# Altium project DARKYDEN.PrjPcb (part 9 of 15)

## Sheet CONNECTEUR_1.SchDoc: DARKYDEN_CONNECTEUR_1
size Letter; ApprovedBy: APPROUVÉ PAR; Author: Harold Malbrouck; Organization: Cegep Limoilou; Address1: 1300, 8e Avenue; Address2: Québec, QC; Address3: Canada; Address4: G1J 5L5; Revision: Rev.B; SheetNumber: 11; SheetTotal: 22
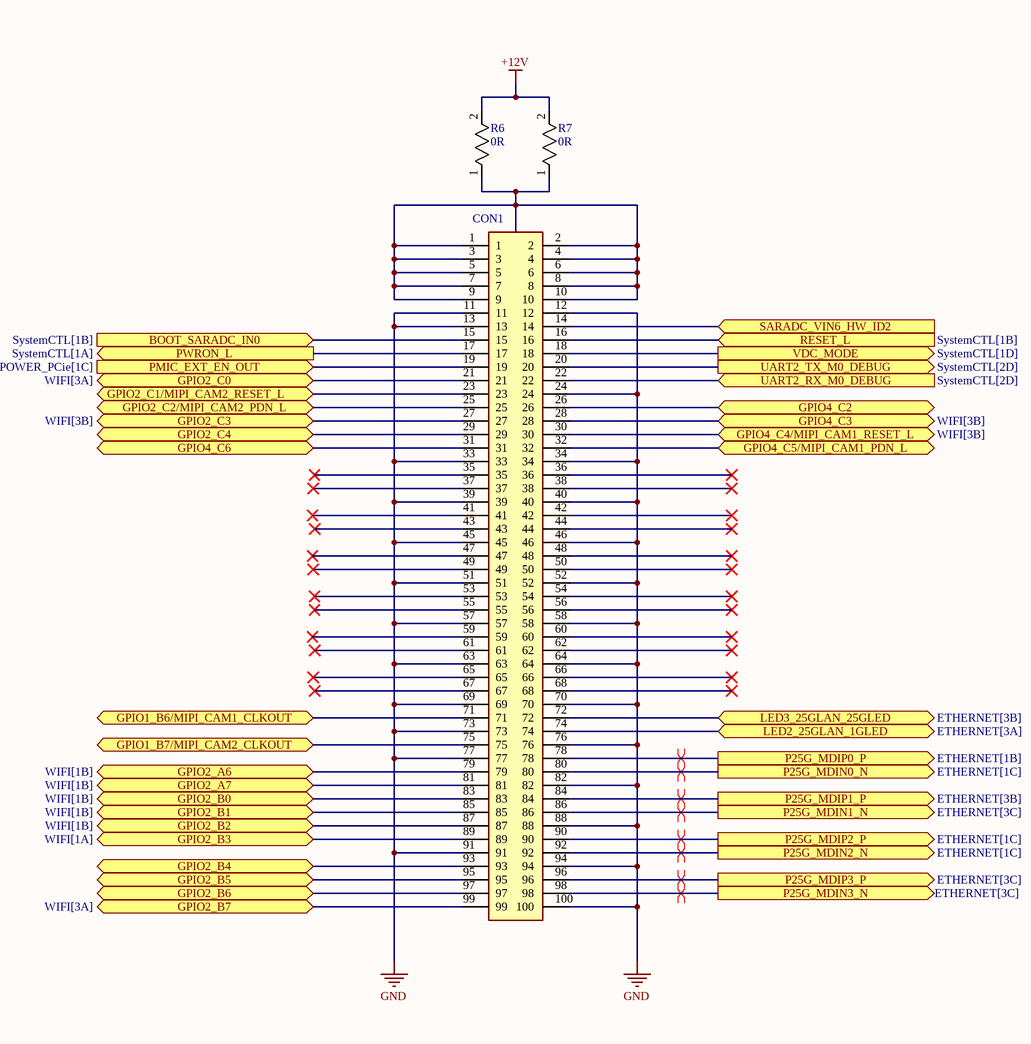
[diagram p10: CONNECTEUR_1.SchDoc, right]

### Parts
CON1  DF40HC  [DF40HC30100DS04V51]  (value not drawn)
R6  0R  [ERJ3EKF1000V]
R7  0R  [ERJ3EKF1000V]

### Ports
BOOT_SARADC_IN0 (in, see SystemCTL[1B]), GPIO1_B6/MIPI_CAM1_CLKOUT (bidir), GPIO1_B7/MIPI_CAM2_CLKOUT (bidir), GPIO2_A6 (bidir, see WIFI[1B]), GPIO2_A7 (bidir, see WIFI[1B]), GPIO2_B0 (bidir, see WIFI[1B]), GPIO2_B1 (bidir, see WIFI[1B]), GPIO2_B2 (bidir, see WIFI[1B]), GPIO2_B3 (bidir, see WIFI[1A]), GPIO2_B4 (bidir), GPIO2_B5 (bidir), GPIO2_B6 (bidir), GPIO2_B7 (bidir, see WIFI[3A]), GPIO2_C0 (bidir, see WIFI[3A]), GPIO2_C1/MIPI_CAM2_RESET_L (bidir), GPIO2_C2/MIPI_CAM2_PDN_L (bidir), GPIO2_C3 (bidir, see WIFI[3B]), GPIO2_C4 (bidir), GPIO4_C2 (bidir), GPIO4_C3 (bidir, see WIFI[3B]), GPIO4_C4/MIPI_CAM1_RESET_L (bidir, see WIFI[3B]), GPIO4_C5/MIPI_CAM1_PDN_L (bidir), GPIO4_C6 (bidir), LED2_25GLAN_1GLED (bidir, see ETHERNET[3A]), LED3_25GLAN_25GLED (bidir, see ETHERNET[3B]), P25G_MDIN0_N (out, see ETHERNET[1C]), P25G_MDIN1_N (out, see ETHERNET[3C]), P25G_MDIN2_N (out, see ETHERNET[1C]), P25G_MDIN3_N (out, see ETHERNET[3C]), P25G_MDIP0_P (out, see ETHERNET[1B]), P25G_MDIP1_P (out, see ETHERNET[3B]), P25G_MDIP2_P (out, see ETHERNET[1C]), P25G_MDIP3_P (out, see ETHERNET[3C]), PMIC_EXT_EN_OUT (in, see Power[1A], Power[1C], POWER_PCie[1B], POWER_PCie[1C]), PWRON_L (out, see SystemCTL[1A]), RESET_L (in, see SystemCTL[1B]), SARADC_VIN6_HW_ID2 (in), UART2_RX_M0_DEBUG (in, see SystemCTL[2D]), UART2_TX_M0_DEBUG (out, see SystemCTL[2D]), VDC_MODE (out, see SystemCTL[1D])

### Nets
+12V: R6.2 R7.2  [project net Vout]
GND: CON1.11 CON1.12 CON1.13 CON1.24 CON1.33 CON1.34 CON1.39 CON1.40 CON1.45 CON1.46 CON1.51 CON1.52 CON1.57 CON1.58 CON1.63 CON1.64 CON1.69 CON1.70 CON1.73 CON1.76 CON1.77 CON1.82 CON1.88 CON1.91 CON1.94 CON1.100  [project net PACK-]
BOOT_SARADC_IN0: CON1.15 ; port BOOT_SARADC_IN0
GPIO1_B6/MIPI_CAM1_CLKOUT: CON1.71 ; port GPIO1_B6/MIPI_CAM1_CLKOUT
GPIO1_B7/MIPI_CAM2_CLKOUT: CON1.75 ; port GPIO1_B7/MIPI_CAM2_CLKOUT
GPIO2_A6: CON1.79 ; port GPIO2_A6
GPIO2_A7: CON1.81 ; port GPIO2_A7
GPIO2_B0: CON1.83 ; port GPIO2_B0
GPIO2_B1: CON1.85 ; port GPIO2_B1
GPIO2_B2: CON1.87 ; port GPIO2_B2
GPIO2_B3: CON1.89 ; port GPIO2_B3
GPIO2_B4: CON1.93 ; port GPIO2_B4
GPIO2_B5: CON1.95 ; port GPIO2_B5
GPIO2_B6: CON1.97 ; port GPIO2_B6
GPIO2_B7: CON1.99 ; port GPIO2_B7
GPIO2_C0: CON1.21 ; port GPIO2_C0
GPIO2_C1/MIPI_CAM2_RESET_L: CON1.23 ; port GPIO2_C1/MIPI_CAM2_RESET_L
GPIO2_C2/MIPI_CAM2_PDN_L: CON1.25 ; port GPIO2_C2/MIPI_CAM2_PDN_L
GPIO2_C3: CON1.27 ; port GPIO2_C3
GPIO2_C4: CON1.29 ; port GPIO2_C4
GPIO4_C2: CON1.26 ; port GPIO4_C2
GPIO4_C3: CON1.28 ; port GPIO4_C3
GPIO4_C4/MIPI_CAM1_RESET_L: CON1.30 ; port GPIO4_C4/MIPI_CAM1_RESET_L
GPIO4_C5/MIPI_CAM1_PDN_L: CON1.32 ; port GPIO4_C5/MIPI_CAM1_PDN_L
GPIO4_C6: CON1.31 ; port GPIO4_C6
LED2_25GLAN_1GLED: CON1.74 ; port LED2_25GLAN_1GLED
LED3_25GLAN_25GLED: CON1.72 ; port LED3_25GLAN_25GLED
MDIP0_N: CON1.80 ; port P25G_MDIN0_N
MDIP0_P: CON1.78 ; port P25G_MDIP0_P
MDIP1_N: CON1.86 ; port P25G_MDIN1_N
MDIP1_P: CON1.84 ; port P25G_MDIP1_P
MDIP2_N: CON1.92 ; port P25G_MDIN2_N
MDIP2_P: CON1.90 ; port P25G_MDIP2_P
MDIP3_N: CON1.98 ; port P25G_MDIN3_N
MDIP3_P: CON1.96 ; port P25G_MDIP3_P
PMIC_EXT_EN_OUT: CON1.19 ; port PMIC_EXT_EN_OUT
PWRON_L: CON1.17 ; port PWRON_L
RESET_L: CON1.16 ; port RESET_L
SARADC_VIN6_HW_ID2: CON1.14 ; port SARADC_VIN6_HW_ID2
UART2_RX_M0_DEBUG: CON1.22 ; port UART2_RX_M0_DEBUG
UART2_TX_M0_DEBUG: CON1.20 ; port UART2_TX_M0_DEBUG
VDC_MODE: CON1.18 ; port VDC_MODE
NetCON1_1: CON1.1 CON1.2 CON1.3 CON1.4 CON1.5 CON1.6 CON1.7 CON1.8 CON1.9 CON1.10 R6.1 R7.1

Not connected (* = marked no-connect by the designer): CON1 35* 36* 37* 38* 41* 42* 43* 44* 47* 48* 49* 50* 53* 54* 55* 56* 59* 60* 61* 62* 65* 66* 67* 68*

### Layout directives
differential pair: MDIP0_N, MDIP0_P, MDIP1_N, MDIP1_P, MDIP2_N, MDIP2_P, MDIP3_N, MDIP3_P

### Notes on the sheet
- Titre :
- Conception :
- Date :
- Approbation :
- Heure :
- Révision :
- Feuille
- de
- Fichier :

### Library data of the parts
CON1 = DF40HC(3.0)-100DS-0.4V(51): Stacking Board Connector, DF40 Series, Receptacle, 0.4 mm, 100, Surface Mount, G; Manufacturer_Name: Hirose; Number of Positions: 100; Contact Resistance: 90mR; Contact Voltage Rating (AC): 30V; Current Rating: 300mA; Mated Stacking Heights: 3mm; Contact Pitch: 400um; Datasheet Link: https://componentsearchengine.com/Datasheets/1/DF40HC(3.0)-100DS-0.4V(51.pdf; Height: 3.05mm; Manufacturer_Part_Number: DF40HC(3.0)-100DS-0.4V(51; Mouser Part Number: 798-DF40HC30100DS451; Mouser Price/Stock: https://www.mouser.co.uk/ProductDetail/Hirose-Connector/DF40HC3.0-100DS-0.4V51?qs=%252BAZVS4b%2FkgIV%252B3vHYy2dCA%3D%3D; Arrow Part Number: DF40HC(3.0)-100DS-0.4V(51; Arrow Price/Stock: https://www.arrow.com/en/products/df40hc-3.0-100ds-0.4v-51/hirose-electric; Supplier: Digikey; Supplier Part Number: 26-DF40HC(3.0)-100DS-0.4V(51)CT-ND; Manufacturer: Hirose; Manufacturer Part Number: DF40HC(3.0)-100DS-0.4V(51; RoHS: Yes; Category: Headers and Wire Housings; Stock: 5604; Pricing: 1=2.61, 10=2.219, 25=2.0796, 50=1.9804, 100=1.8858, 250=1.76764, 500=1.68326, 1000=1.6524 (USD); Mounting Technology: Surface Mount; Contact Plating: Gold; Contact Material: Nickel,Gold; Housing Color: Black; Min Operating Temperature: -35°C; Max Operating Temperature: 85°C; Package Quantity: 3000; Packaging: Tape and Reel; Number of Rows: 2; Connector Type: Receptacle; Series: DF40; Contact Voltage Rating (DC): 30V; Number of Contacts: 100; Orientation: Straight; Voltage Rating: 30V; Length: 22.6mm; Width: 3.38mm; ComponentLink1URL: https://datasheet.ciiva.com/13559/ed-df40-20140305-13559540.pdf?src-supplier=Mouser; ComponentLink1Description: https://datasheet.ciiva.com/13559/ed-df40-20140305-13559540.pdf?src-supplier=Mouser
R6 R7 = ERJ-3GEY0R00V: Zero Ohm Resistor, Jumper, 0603 [1608 Metric], Thick Film, 100 mW, 1 A, Surface Mount; Manufacturer_Name: Panasonic; Power Rating: 100mW; Voltage Rating: 75V; Tolerance: 0%; Temperature Coefficient: 200ppm/°C; Datasheet Link: http://docs-europe.electrocomponents.com/webdocs/13ba/0900766b813ba21b.pdf; Height: 0.55mm; Manufacturer_Part_Number: ERJ-3GEY0R00V; Mouser Part Number: 667-ERJ-3GEY0R00V; Mouser Price/Stock: https://www.mouser.co.uk/ProductDetail/Panasonic/ERJ-3GEY0R00V?qs=66DK8nO8gJALIOqOWgiVwg%3D%3D; Arrow Part Number: ERJ-3GEY0R00V; Arrow Price/Stock: https://www.arrow.com/en/products/erj3gey0r00v/panasonic?region=europe; Supplier: Digikey; Supplier Part Number: P0.0GCT-ND; Manufacturer: Panasonic; Manufacturer Part Number: ERJ-3GEY0R00V; RoHS: Yes; Category: Chip SMD Resistors; Stock: 766631; Pricing: 1=0.1, 10=0.02, 25=0.0164, 50=0.0144, 100=0.0126, 250=0.0106, 500=0.00936, 1000=0.0083 (USD); Mounting Technology: Surface Mount; Case/Package: 0603; Case Code (Metric): 1608; Case Code (Imperial): 0603; Contact Plating: Tin; Min Operating Temperature: -55°C; Max Operating Temperature: 155°C; Packaging: Tape and Reel; Package Quantity: 5000; Value: 0R; Resistor Type: Thick Film; Number of Terminations: 2; Termination: SMD/SMT; Max Power Dissipation: 100mW; Features: Automotive AEC-Q200; Series: ERJ; Construction: Rectangular; Technology: THICK FILM; Length: 1.6mm; Width: 0.8mm; Depth: 0.8mm; Ratings: AEC-Q200; Radiation Hardening: No; Reach SVHC Compliant: No; Military Standard: Not; RoHS Compliant: Yes; Lead Free: 5697LeadFree; ComponentLink1URL: https://datasheet.ciiva.com/11808/0900766b80f806dd-11808207.pdf?src-supplier=Rs; ComponentLink1Description: https://datasheet.ciiva.com/11808/0900766b80f806dd-11808207.pdf?src-supplier=Rs; ComponentLink2URL: https://datasheet.ciiva.com/27055/1935748-27055113.pdf?src-supplier=Jameco; ComponentLink2Description: https://datasheet.ciiva.com/27055/1935748-27055113.pdf?src-supplier=Jameco; ComponentLink3URL: https://datasheet.ciiva.com/5959/1678796-5959707.pdf?src-supplier=Farnell; ComponentLink3Description: https://datasheet.ciiva.com/5959/1678796-5959707.pdf?src-supplier=Farnell; ComponentLink4URL: https://datasheet.ciiva.com/43460/1678796-43460647.pdf?src-supplier=Farnell; ComponentLink4Description: https://datasheet.ciiva.com/43460/1678796-43460647.pdf?src-supplier=Farnell; ComponentLink5URL: https://datasheet.ciiva.com/48532/aoa0000ce1-48532165.pdf?src-supplier=Avnet; ComponentLink5Description: https://datasheet.ciiva.com/48532/aoa0000ce1-48532165.pdf?src-supplier=Avnet; ComponentLink6URL: https://datasheet.ciiva.com/28695/1678796-28695833.pdf?src-supplier=Element14; ComponentLink6Description: https://datasheet.ciiva.com/28695/1678796-28695833.pdf?src-supplier=Element14; ComponentLink7URL: https://datasheet.ciiva.com/16834/aoa0000ce1-16834828.pdf?src-supplier=Future+Electronics; ComponentLink7Description: https://datasheet.ciiva.com/16834/aoa0000ce1-16834828.pdf?src-supplier=Future+Electronics; ComponentLink8URL: https://datasheet.ciiva.com/16758/70255313-16758527.pdf?src-supplier=Allied+Electronics; ComponentLink8Description: https://datasheet.ciiva.com/16758/70255313-16758527.pdf?src-supplier=Allied+Electronics; ComponentLink9URL: https://datasheet.ciiva.com/30199/4aoa0000ce1-30199822.pdf?src-supplier=Onlinecomponents.com; ComponentLink9Description: https://datasheet.ciiva.com/30199/4aoa0000ce1-30199822.pdf?src-supplier=Onlinecomponents.com; ComponentLink10URL: https://datasheet.ciiva.com/46377/1678796-46377868.pdf?src-supplier=Element14; ComponentLink10Description: https://datasheet.ciiva.com/46377/1678796-46377868.pdf?src-supplier=Element14; ComponentLink11URL: https://datasheet.ciiva.com/9198/aoa0000ce1-9198975.pdf?src-supplier=Avnet; ComponentLink11Description: https://datasheet.ciiva.com/9198/aoa0000ce1-9198975.pdf?src-supplier=Avnet

## Sheet CONNECTEUR_2.SchDoc: DARKYDEN_CONNECTEUR_2
size Letter; ApprovedBy: APPROUVÉ PAR; Author: Harold Malbrouck; Organization: Cegep Limoilou; Address1: 1300, 8e Avenue; Address2: Québec, QC; Address3: Canada; Address4: G1J 5L5; Revision: Rev.B; SheetNumber: 12; SheetTotal: 22
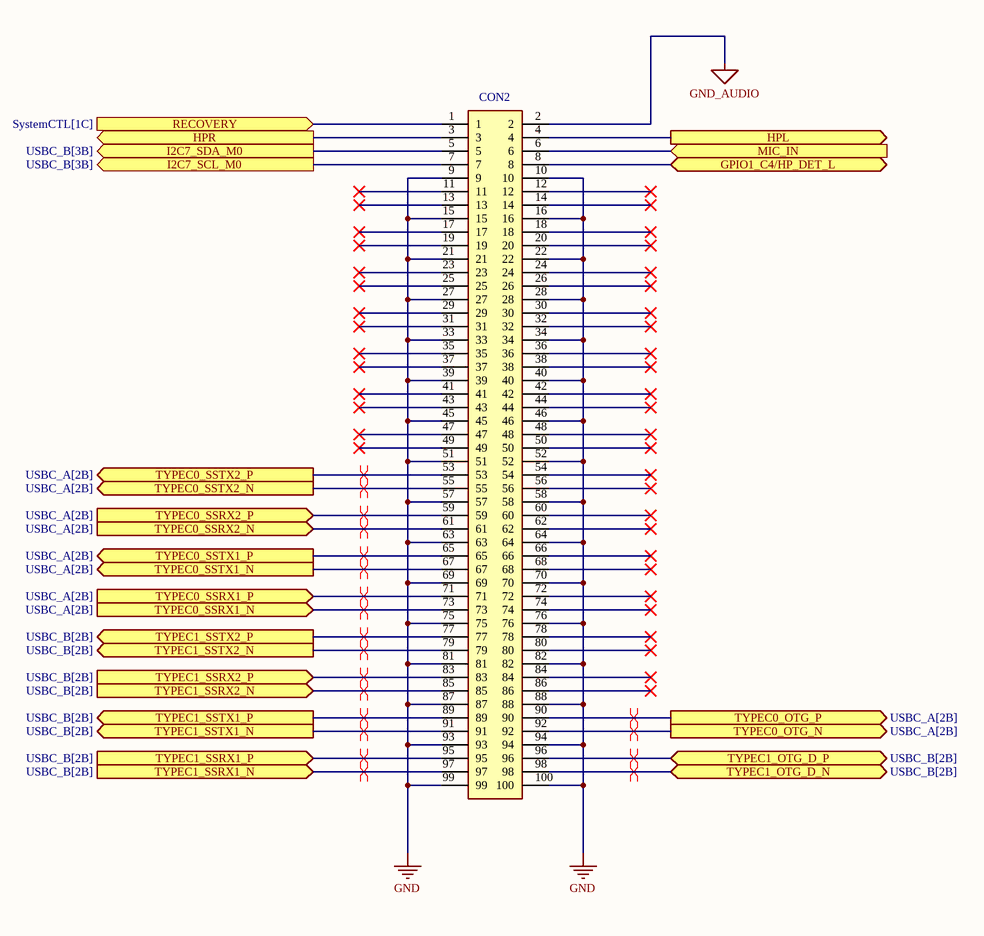
[diagram p11: CONNECTEUR_2.SchDoc, middle]

### Parts
CON2  DF40HC  [DF40HC30100DS04V51]  (value not drawn)

### Ports
GPIO1_C4/HP_DET_L (bidir), HPL (out), HPR (out), I2C7_SCL_M0 (out, see USBC_B[3B]), I2C7_SDA_M0 (out, see USBC_B[3B]), MIC_IN (in), RECOVERY (in, see SystemCTL[1C]), TYPEC0_OTG_N (out, see USBC_A[2B]), TYPEC0_OTG_P (out, see USBC_A[2B]), TYPEC0_SSRX1_N (in, see USBC_A[2B]), TYPEC0_SSRX1_P (in, see USBC_A[2B]), TYPEC0_SSRX2_N (in, see USBC_A[2B]), TYPEC0_SSRX2_P (in, see USBC_A[2B]), TYPEC0_SSTX1_N (out, see USBC_A[2B]), TYPEC0_SSTX1_P (out, see USBC_A[2B]), TYPEC0_SSTX2_N (out, see USBC_A[2B]), TYPEC0_SSTX2_P (out, see USBC_A[2B]), TYPEC1_OTG_D_N (bidir, see USBC_B[2B]), TYPEC1_OTG_D_P (bidir, see USBC_B[2B]), TYPEC1_SSRX1_N (in, see USBC_B[2B]), TYPEC1_SSRX1_P (in, see USBC_B[2B]), TYPEC1_SSRX2_N (in, see USBC_B[2B]), TYPEC1_SSRX2_P (in, see USBC_B[2B]), TYPEC1_SSTX1_N (out, see USBC_B[2B]), TYPEC1_SSTX1_P (out, see USBC_B[2B]), TYPEC1_SSTX2_N (out, see USBC_B[2B]), TYPEC1_SSTX2_P (out, see USBC_B[2B])

### Nets
GND: CON2.9 CON2.10 CON2.15 CON2.16 CON2.21 CON2.22 CON2.27 CON2.28 CON2.33 CON2.34 CON2.39 CON2.40 CON2.45 CON2.46 CON2.51 CON2.52 CON2.57 CON2.58 CON2.63 CON2.64 CON2.69 CON2.70 CON2.75 CON2.76 CON2.81 CON2.82 CON2.87 CON2.88 CON2.93 CON2.94 CON2.99 CON2.100  [project net PACK-]
GND_AUDIO: CON2.2
GPIO1_C4/HP_DET_L: CON2.8 ; port GPIO1_C4/HP_DET_L
HPL: CON2.4 ; port HPL
HPR: CON2.3 ; port HPR
MIC_IN: CON2.6 ; port MIC_IN
RECOVERY: CON2.1 ; port RECOVERY
RRX1_N: CON2.97 ; port TYPEC1_SSRX1_N
RRX1_P: CON2.95 ; port TYPEC1_SSRX1_P
RRX2_N: CON2.85 ; port TYPEC1_SSRX2_N
RRX2_P: CON2.83 ; port TYPEC1_SSRX2_P
RX1_N: CON2.73 ; port TYPEC0_SSRX1_N
RX1_P: CON2.71 ; port TYPEC0_SSRX1_P
RX2_N: CON2.61 ; port TYPEC0_SSRX2_N
RX2_P: CON2.59 ; port TYPEC0_SSRX2_P
SCL: CON2.7 ; port I2C7_SCL_M0
SDA: CON2.5 ; port I2C7_SDA_M0
TTX1_N: CON2.91 ; port TYPEC1_SSTX1_N
TTX1_P: CON2.89 ; port TYPEC1_SSTX1_P
TTX2_N: CON2.79 ; port TYPEC1_SSTX2_N
TTX2_P: CON2.77 ; port TYPEC1_SSTX2_P
TX1_N: CON2.67 ; port TYPEC0_SSTX1_N
TX1_P: CON2.65 ; port TYPEC0_SSTX1_P
TX2_N: CON2.55 ; port TYPEC0_SSTX2_N
TX2_P: CON2.53 ; port TYPEC0_SSTX2_P
TYPEC0_OTG_N: CON2.92 ; port TYPEC0_OTG_N
TYPEC0_OTG_P: CON2.90 ; port TYPEC0_OTG_P
TYPEC1_OTG_D_N: CON2.98 ; port TYPEC1_OTG_D_N
TYPEC1_OTG_D_P: CON2.96 ; port TYPEC1_OTG_D_P

Not connected (* = marked no-connect by the designer): CON2 11* 12* 13* 14* 17* 18* 19* 20* 23* 24* 25* 26* 29* 30* 31* 32* 35* 36* 37* 38* 41* 42* 43* 44* 47* 48* 49* 50* 54* 56* 60* 62* 66* 68* 72* 74* 78* 80* 84* 86*

### Layout directives
differential pair: RRX1_N, RRX1_P, RRX2_N, RRX2_P, RX1_N, RX1_P, RX2_N, RX2_P, TTX1_N, TTX1_P, TTX2_N, TTX2_P, TX1_N, TX1_P, TX2_N, TX2_P, TYPEC0_OTG_N, TYPEC0_OTG_P, TYPEC1_OTG_D_N, TYPEC1_OTG_D_P

### Notes on the sheet
- Titre :
- Conception :
- Date :
- Approbation :
- Heure :
- Révision :
- Feuille
- de
- Fichier :

### Library data of the parts
CON2 = DF40HC(3.0)-100DS-0.4V(51): as CON1 on sheet CONNECTEUR_1; Datasheet Link: https://componentsearchengine.com/Datasheets/1/DF40HC(3.0)-100DS-0.4V(51.pdf; Height: 3.05mm; Manufacturer_Part_Number: DF40HC(3.0)-100DS-0.4V(51; Mouser Part Number: 798-DF40HC30100DS451; Mouser Price/Stock: https://www.mouser.co.uk/ProductDetail/Hirose-Connector/DF40HC3.0-100DS-0.4V51?qs=%252BAZVS4b%2FkgIV%252B3vHYy2dCA%3D%3D; Arrow Part Number: DF40HC(3.0)-100DS-0.4V(51; Arrow Price/Stock: https://www.arrow.com/en/products/df40hc-3.0-100ds-0.4v-51/hirose-electric; Supplier: Digikey; Supplier Part Number: 26-DF40HC(3.0)-100DS-0.4V(51)CT-ND; Manufacturer: Hirose; Manufacturer Part Number: DF40HC(3.0)-100DS-0.4V(51; RoHS: Yes; Category: Headers and Wire Housings; Stock: 5604; Pricing: 1=2.61, 10=2.219, 25=2.0796, 50=1.9804, 100=1.8858, 250=1.76764, 500=1.68326, 1000=1.6524 (USD); Mounting Technology: Surface Mount; Contact Plating: Gold; Contact Material: Nickel,Gold; Housing Color: Black; Min Operating Temperature: -35°C; Max Operating Temperature: 85°C; Package Quantity: 3000; Packaging: Tape and Reel; Number of Rows: 2; Connector Type: Receptacle; Series: DF40; Contact Voltage Rating (DC): 30V; Number of Contacts: 100; Orientation: Straight; Voltage Rating: 30V; Length: 22.6mm; Width: 3.38mm; ComponentLink1URL: https://datasheet.ciiva.com/13559/ed-df40-20140305-13559540.pdf?src-supplier=Mouser; ComponentLink1Description: https://datasheet.ciiva.com/13559/ed-df40-20140305-13559540.pdf?src-supplier=Mouser

## Sheet CONNECTEUR_3.SchDoc: DARKYDEN_CONNECTEUR_3
size Letter; ApprovedBy: APPROUVÉ PAR; Author: Harold Malbrouck; Organization: Cegep Limoilou; Address1: 1300, 8e Avenue; Address2: Québec, QC; Address3: Canada; Address4: G1J 5L5; Revision: Rev.C; SheetNumber: 13; SheetTotal: 22
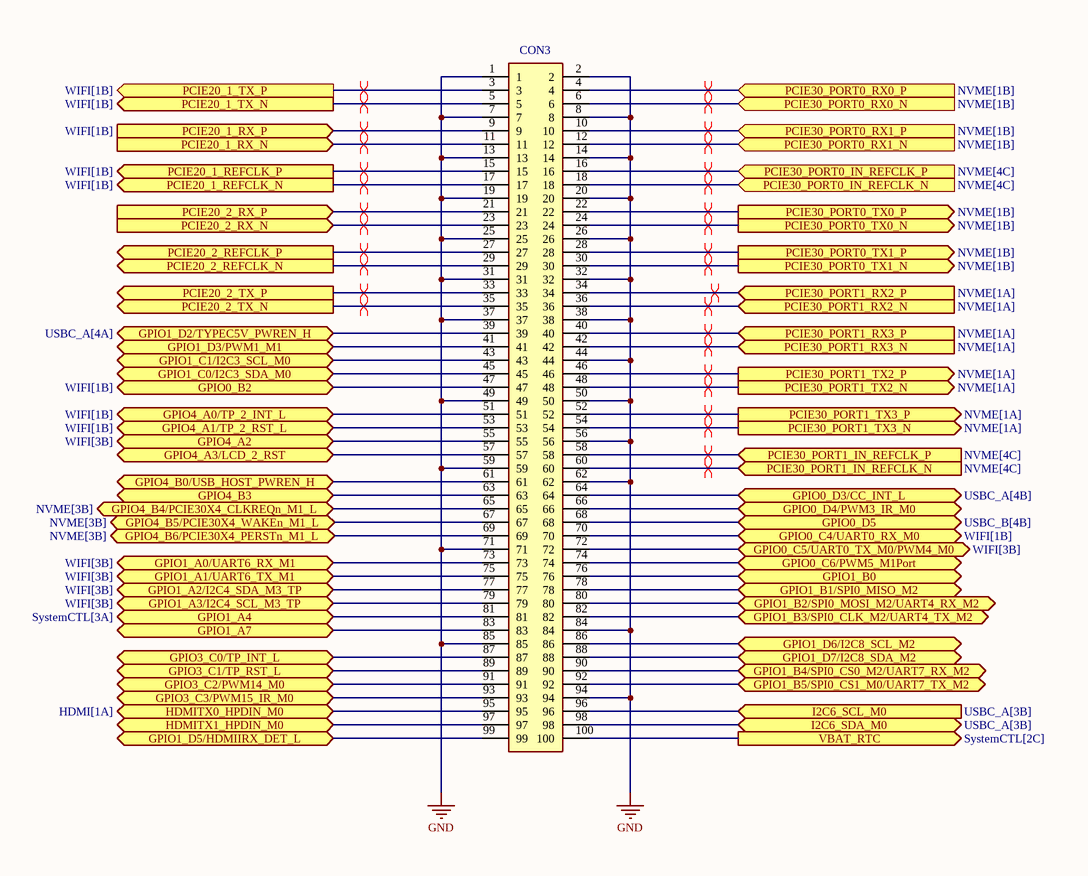
[diagram p12: CONNECTEUR_3.SchDoc, right]

### Parts
CON3  DF40HC  [DF40HC30100DS04V51]  (value not drawn)

### Ports
GPIO0_B2 (bidir, see WIFI[1B]), GPIO0_C4/UART0_RX_M0 (bidir, see WIFI[1B]), GPIO0_C5/UART0_TX_M0/PWM4_M0 (bidir, see WIFI[3B]), GPIO0_C6/PWM5_M1Port (bidir), GPIO0_D3/CC_INT_L (bidir, see USBC_A[4B]), GPIO0_D4/PWM3_IR_M0 (bidir), GPIO0_D5 (bidir, see USBC_B[4B]), GPIO1_A0/UART6_RX_M1 (bidir, see WIFI[3B]), GPIO1_A1/UART6_TX_M1 (bidir, see WIFI[3B]), GPIO1_A2/I2C4_SDA_M3_TP (bidir, see WIFI[3B]), GPIO1_A3/I2C4_SCL_M3_TP (bidir, see WIFI[3B]), GPIO1_A4 (bidir, see SystemCTL[3A]), GPIO1_A7 (bidir), GPIO1_B0 (bidir), GPIO1_B1/SPI0_MISO_M2 (bidir), GPIO1_B2/SPI0_MOSI_M2/UART4_RX_M2 (bidir), GPIO1_B3/SPI0_CLK_M2/UART4_TX_M2 (bidir), GPIO1_B4/SPI0_CS0_M2/UART7_RX_M2 (bidir), GPIO1_B5/SPI0_CS1_M0/UART7_TX_M2 (bidir), GPIO1_C0/I2C3_SDA_M0 (bidir), GPIO1_C1/I2C3_SCL_M0 (bidir), GPIO1_D2/TYPEC5V_PWREN_H (bidir, see USBC_A[4A]), GPIO1_D3/PWM1_M1 (bidir), GPIO1_D5/HDMIIRX_DET_L (bidir), GPIO1_D6/I2C8_SCL_M2 (bidir), GPIO1_D7/I2C8_SDA_M2 (bidir), GPIO3_C0/TP_INT_L (bidir), GPIO3_C1/TP_RST_L (bidir), GPIO3_C2/PWM14_M0 (bidir), GPIO3_C3/PWM15_IR_M0 (bidir), GPIO4_A0/TP_2_INT_L (bidir, see WIFI[1B]), GPIO4_A1/TP_2_RST_L (bidir, see WIFI[1B]), GPIO4_A2 (bidir, see WIFI[3B]), GPIO4_A3/LCD_2_RST (bidir), GPIO4_B0/USB_HOST_PWREN_H (bidir), GPIO4_B3 (bidir), GPIO4_B4/PCIE30X4_CLKREQn_M1_L (bidir, see NVME[3B]), GPIO4_B5/PCIE30X4_WAKEn_M1_L (bidir, see NVME[3B]), GPIO4_B6/PCIE30X4_PERSTn_M1_L (bidir, see NVME[3B]), HDMITX0_HPDIN_M0 (bidir, see HDMI[1A]), HDMITX1_HPDIN_M0 (bidir), I2C6_SCL_M0 (in, see USBC_A[3B]), I2C6_SDA_M0 (bidir, see USBC_A[3B]), PCIE20_1_REFCLK_N (out, see WIFI[1B]), PCIE20_1_REFCLK_P (out, see WIFI[1B]), PCIE20_1_RX_N (in), PCIE20_1_RX_P (in, see WIFI[1B]), PCIE20_1_TX_N (out, see WIFI[1B]), PCIE20_1_TX_P (out, see WIFI[1B]), PCIE20_2_REFCLK_N (out), PCIE20_2_REFCLK_P (out), PCIE20_2_RX_N (in), PCIE20_2_RX_P (in), PCIE20_2_TX_N (out), PCIE20_2_TX_P (out), PCIE30_PORT0_IN_REFCLK_N (in, see NVME[4C]), PCIE30_PORT0_IN_REFCLK_P (in, see NVME[4C]), PCIE30_PORT0_RX0_N (in, see NVME[1B]), PCIE30_PORT0_RX0_P (in, see NVME[1B]), PCIE30_PORT0_RX1_N (in, see NVME[1B]), PCIE30_PORT0_RX1_P (in, see NVME[1B]), PCIE30_PORT0_TX0_N (out, see NVME[1B]), PCIE30_PORT0_TX0_P (out, see NVME[1B]), PCIE30_PORT0_TX1_N (out, see NVME[1B]), PCIE30_PORT0_TX1_P (out, see NVME[1B]), PCIE30_PORT1_IN_REFCLK_N (in, see NVME[4C]), PCIE30_PORT1_IN_REFCLK_P (in, see NVME[4C]), PCIE30_PORT1_RX2_N (in, see NVME[1A]), PCIE30_PORT1_RX2_P (in, see NVME[1A]), PCIE30_PORT1_RX3_N (in, see NVME[1A]), PCIE30_PORT1_RX3_P (in, see NVME[1A]), PCIE30_PORT1_TX2_N (out, see NVME[1A]), PCIE30_PORT1_TX2_P (out, see NVME[1A]), PCIE30_PORT1_TX3_N (out, see NVME[1A]), PCIE30_PORT1_TX3_P (out, see NVME[1A]), VBAT_RTC (out, see SystemCTL[2C])

### Nets
GND: CON3.1 CON3.2 CON3.7 CON3.8 CON3.13 CON3.14 CON3.19 CON3.20 CON3.25 CON3.26 CON3.31 CON3.32 CON3.37 CON3.38 CON3.44 CON3.49 CON3.50 CON3.56 CON3.59 CON3.62 CON3.71 CON3.84 CON3.85 CON3.94  [project net PACK-]
EN: CON3.39 ; port GPIO1_D2/TYPEC5V_PWREN_H
GPIO0_B2: CON3.47 ; port GPIO0_B2
GPIO0_C4/UART0_RX_M0: CON3.70 ; port GPIO0_C4/UART0_RX_M0
GPIO0_C5/UART0_TX_M0/PWM4_M0: CON3.72 ; port GPIO0_C5/UART0_TX_M0/PWM4_M0
GPIO0_C6/PWM5_M1Port: CON3.74 ; port GPIO0_C6/PWM5_M1Port
GPIO0_D3/CC_INT_L: CON3.64 ; port GPIO0_D3/CC_INT_L
GPIO0_D4/PWM3_IR_M0: CON3.66 ; port GPIO0_D4/PWM3_IR_M0
GPIO0_D5: CON3.68 ; port GPIO0_D5
GPIO1_A0/UART6_RX_M1: CON3.73 ; port GPIO1_A0/UART6_RX_M1
GPIO1_A1/UART6_TX_M1: CON3.75 ; port GPIO1_A1/UART6_TX_M1
GPIO1_A2/I2C4_SDA_M3_TP: CON3.77 ; port GPIO1_A2/I2C4_SDA_M3_TP
GPIO1_A3/I2C4_SCL_M3_TP: CON3.79 ; port GPIO1_A3/I2C4_SCL_M3_TP
GPIO1_A4: CON3.81 ; port GPIO1_A4
GPIO1_A7: CON3.83 ; port GPIO1_A7
GPIO1_B0: CON3.76 ; port GPIO1_B0
GPIO1_B1/SPI0_MISO_M2: CON3.78 ; port GPIO1_B1/SPI0_MISO_M2
GPIO1_B2/SPI0_MOSI_M2/UART4_RX_M2: CON3.80 ; port GPIO1_B2/SPI0_MOSI_M2/UART4_RX_M2
GPIO1_B3/SPI0_CLK_M2/UART4_TX_M2: CON3.82 ; port GPIO1_B3/SPI0_CLK_M2/UART4_TX_M2
GPIO1_B4/SPI0_CS0_M2/UART7_RX_M2: CON3.90 ; port GPIO1_B4/SPI0_CS0_M2/UART7_RX_M2
GPIO1_B5/SPI0_CS1_M0/UART7_TX_M2: CON3.92 ; port GPIO1_B5/SPI0_CS1_M0/UART7_TX_M2
GPIO1_C0/I2C3_SDA_M0: CON3.45 ; port GPIO1_C0/I2C3_SDA_M0
GPIO1_C1/I2C3_SCL_M0: CON3.43 ; port GPIO1_C1/I2C3_SCL_M0
GPIO1_D3/PWM1_M1: CON3.41 ; port GPIO1_D3/PWM1_M1
GPIO1_D5/HDMIIRX_DET_L: CON3.99 ; port GPIO1_D5/HDMIIRX_DET_L
GPIO1_D6/I2C8_SCL_M2: CON3.86 ; port GPIO1_D6/I2C8_SCL_M2
GPIO1_D7/I2C8_SDA_M2: CON3.88 ; port GPIO1_D7/I2C8_SDA_M2
GPIO3_C0/TP_INT_L: CON3.87 ; port GPIO3_C0/TP_INT_L
GPIO3_C1/TP_RST_L: CON3.89 ; port GPIO3_C1/TP_RST_L
GPIO3_C2/PWM14_M0: CON3.91 ; port GPIO3_C2/PWM14_M0
GPIO3_C3/PWM15_IR_M0: CON3.93 ; port GPIO3_C3/PWM15_IR_M0
GPIO4_A0/TP_2_INT_L: CON3.51 ; port GPIO4_A0/TP_2_INT_L
GPIO4_A1/TP_2_RST_L: CON3.53 ; port GPIO4_A1/TP_2_RST_L
GPIO4_A2: CON3.55 ; port GPIO4_A2
GPIO4_A3/LCD_2_RST: CON3.57 ; port GPIO4_A3/LCD_2_RST
GPIO4_B0/USB_HOST_PWREN_H: CON3.61 ; port GPIO4_B0/USB_HOST_PWREN_H
GPIO4_B3: CON3.63 ; port GPIO4_B3
GPIO4_B4/PCIE30X4_CLKREQn_M1_L: CON3.65 ; port GPIO4_B4/PCIE30X4_CLKREQn_M1_L
GPIO4_B5/PCIE30X4_WAKEn_M1_L: CON3.67 ; port GPIO4_B5/PCIE30X4_WAKEn_M1_L
GPIO4_B6/PCIE30X4_PERSTn_M1_L: CON3.69 ; port GPIO4_B6/PCIE30X4_PERSTn_M1_L
HDMITX0_HPDIN_M0: CON3.95 ; port HDMITX0_HPDIN_M0
HDMITX1_HPDIN_M0: CON3.97 ; port HDMITX1_HPDIN_M0
PCIE20_1_REFCLK_N: CON3.17 ; port PCIE20_1_REFCLK_N
PCIE20_1_REFCLK_P: CON3.15 ; port PCIE20_1_REFCLK_P
PCIE20_1_RX_N: CON3.11 ; port PCIE20_1_RX_N
PCIE20_1_RX_P: CON3.9 ; port PCIE20_1_RX_P
PCIE20_1_TX_N: CON3.5 ; port PCIE20_1_TX_N
PCIE20_1_TX_P: CON3.3 ; port PCIE20_1_TX_P
PCIE20_2_REFCLK_N: CON3.29 ; port PCIE20_2_REFCLK_N
PCIE20_2_REFCLK_P: CON3.27 ; port PCIE20_2_REFCLK_P
PCIE20_2_RX_N: CON3.23 ; port PCIE20_2_RX_N
PCIE20_2_RX_P: CON3.21 ; port PCIE20_2_RX_P
PCIE20_2_TX_N: CON3.35 ; port PCIE20_2_TX_N
PCIE20_2_TX_P: CON3.33 ; port PCIE20_2_TX_P
PCIE30_PORT0_IN_REFCLK_N: CON3.18 ; port PCIE30_PORT0_IN_REFCLK_N
PCIE30_PORT0_IN_REFCLK_P: CON3.16 ; port PCIE30_PORT0_IN_REFCLK_P
PCIE30_PORT0_RX0_N: CON3.6 ; port PCIE30_PORT0_RX0_N
PCIE30_PORT0_RX0_P: CON3.4 ; port PCIE30_PORT0_RX0_P
PCIE30_PORT0_RX1_N: CON3.12 ; port PCIE30_PORT0_RX1_N
PCIE30_PORT0_RX1_P: CON3.10 ; port PCIE30_PORT0_RX1_P
PCIE30_PORT0_TX0_N: CON3.24 ; port PCIE30_PORT0_TX0_N
PCIE30_PORT0_TX0_P: CON3.22 ; port PCIE30_PORT0_TX0_P
PCIE30_PORT0_TX1_N: CON3.30 ; port PCIE30_PORT0_TX1_N
PCIE30_PORT0_TX1_P: CON3.28 ; port PCIE30_PORT0_TX1_P
PCIE30_PORT1_IN_REFCLK_N: CON3.60 ; port PCIE30_PORT1_IN_REFCLK_N
PCIE30_PORT1_IN_REFCLK_P: CON3.58 ; port PCIE30_PORT1_IN_REFCLK_P
PCIE30_PORT1_RX2_N: CON3.36 ; port PCIE30_PORT1_RX2_N
PCIE30_PORT1_RX2_P: CON3.34 ; port PCIE30_PORT1_RX2_P
PCIE30_PORT1_RX3_N: CON3.42 ; port PCIE30_PORT1_RX3_N
PCIE30_PORT1_RX3_P: CON3.40 ; port PCIE30_PORT1_RX3_P
PCIE30_PORT1_TX2_N: CON3.48 ; port PCIE30_PORT1_TX2_N
PCIE30_PORT1_TX2_P: CON3.46 ; port PCIE30_PORT1_TX2_P
PCIE30_PORT1_TX3_N: CON3.54 ; port PCIE30_PORT1_TX3_N
PCIE30_PORT1_TX3_P: CON3.52 ; port PCIE30_PORT1_TX3_P
SCL: CON3.96 ; port I2C6_SCL_M0
SDA: CON3.98 ; port I2C6_SDA_M0
VBAT_RTC: CON3.100 ; port VBAT_RTC

### Layout directives
differential pair: PCIE20_1_REFCLK_N, PCIE20_1_REFCLK_P, PCIE20_1_RX_N, PCIE20_1_RX_P, PCIE20_1_TX_N, PCIE20_1_TX_P, PCIE20_2_REFCLK_N, PCIE20_2_REFCLK_P, PCIE20_2_RX_N, PCIE20_2_RX_P, PCIE20_2_TX_N, PCIE20_2_TX_P, PCIE30_PORT0_IN_REFCLK_N, PCIE30_PORT0_IN_REFCLK_P, PCIE30_PORT0_RX0_N, PCIE30_PORT0_RX0_P, PCIE30_PORT0_RX1_N, PCIE30_PORT0_RX1_P, PCIE30_PORT0_TX0_N, PCIE30_PORT0_TX0_P, PCIE30_PORT0_TX1_N, PCIE30_PORT0_TX1_P, PCIE30_PORT1_IN_REFCLK_N, PCIE30_PORT1_IN_REFCLK_P, PCIE30_PORT1_RX2_N, PCIE30_PORT1_RX2_P, PCIE30_PORT1_RX3_N, PCIE30_PORT1_RX3_P, PCIE30_PORT1_TX2_N, PCIE30_PORT1_TX2_P, PCIE30_PORT1_TX3_N, PCIE30_PORT1_TX3_P

### Notes on the sheet
- Titre :
- Conception :
- Date :
- Approbation :
- Heure :
- Révision :
- Feuille
- de
- Fichier :

### Library data of the parts
CON3 = DF40HC(3.0)-100DS-0.4V(51): as CON1 on sheet CONNECTEUR_1; Datasheet Link: https://componentsearchengine.com/Datasheets/1/DF40HC(3.0)-100DS-0.4V(51.pdf; Height: 3.05mm; Manufacturer_Part_Number: DF40HC(3.0)-100DS-0.4V(51; Mouser Part Number: 798-DF40HC30100DS451; Mouser Price/Stock: https://www.mouser.co.uk/ProductDetail/Hirose-Connector/DF40HC3.0-100DS-0.4V51?qs=%252BAZVS4b%2FkgIV%252B3vHYy2dCA%3D%3D; Arrow Part Number: DF40HC(3.0)-100DS-0.4V(51; Arrow Price/Stock: https://www.arrow.com/en/products/df40hc-3.0-100ds-0.4v-51/hirose-electric; Supplier: Digikey; Supplier Part Number: 26-DF40HC(3.0)-100DS-0.4V(51)CT-ND; Manufacturer: Hirose; Manufacturer Part Number: DF40HC(3.0)-100DS-0.4V(51; RoHS: Yes; Category: Headers and Wire Housings; Stock: 5604; Pricing: 1=2.61, 10=2.219, 25=2.0796, 50=1.9804, 100=1.8858, 250=1.76764, 500=1.68326, 1000=1.6524 (USD); Mounting Technology: Surface Mount; Contact Plating: Gold; Contact Material: Nickel,Gold; Housing Color: Black; Min Operating Temperature: -35°C; Max Operating Temperature: 85°C; Package Quantity: 3000; Packaging: Tape and Reel; Number of Rows: 2; Connector Type: Receptacle; Series: DF40; Contact Voltage Rating (DC): 30V; Number of Contacts: 100; Orientation: Straight; Voltage Rating: 30V; Length: 22.6mm; Width: 3.38mm; ComponentLink1URL: https://datasheet.ciiva.com/13559/ed-df40-20140305-13559540.pdf?src-supplier=Mouser; ComponentLink1Description: https://datasheet.ciiva.com/13559/ed-df40-20140305-13559540.pdf?src-supplier=Mouser

## Sheet CONNECTEUR_4.SchDoc: DARKYDEN_CONNECTEUR_4
size Letter; ApprovedBy: APPROUVÉ PAR; Author: Harold Malbrouck; Organization: Cegep Limoilou; Address1: 1300, 8e Avenue; Address2: Québec, QC; Address3: Canada; Address4: G1J 5L5; Revision: Rev.B; SheetNumber: 14; SheetTotal: 22
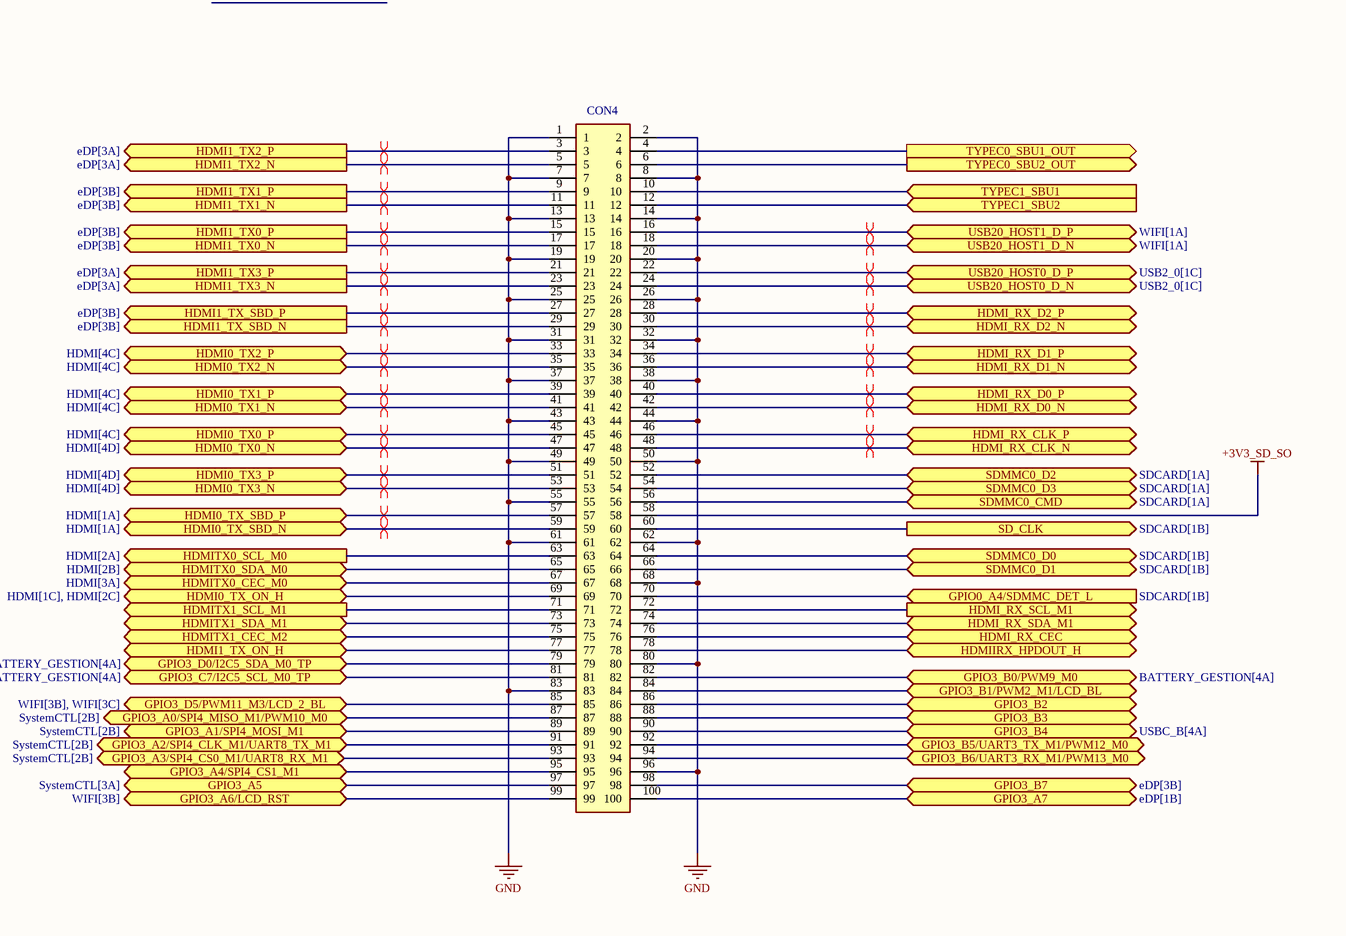
[diagram p13: CONNECTEUR_4.SchDoc, right]

### Parts
CON4  DF40HC  [DF40HC30100DS04V51]  (value not drawn)

### Ports
GPIO0_A4/SDMMC_DET_L (in, see SDCARD[1B]), GPIO3_A0/SPI4_MISO_M1/PWM10_M0 (bidir, see SystemCTL[2B]), GPIO3_A1/SPI4_MOSI_M1 (bidir, see SystemCTL[2B]), GPIO3_A2/SPI4_CLK_M1/UART8_TX_M1 (bidir, see SystemCTL[2B]), GPIO3_A3/SPI4_CS0_M1/UART8_RX_M1 (bidir, see SystemCTL[2B]), GPIO3_A4/SPI4_CS1_M1 (bidir), GPIO3_A5 (bidir, see SystemCTL[3A]), GPIO3_A6/LCD_RST (bidir, see WIFI[3B]), GPIO3_A7 (bidir, see eDP[1B]), GPIO3_B0/PWM9_M0 (bidir, see BATTERY_GESTION[4A]), GPIO3_B1/PWM2_M1/LCD_BL (bidir), GPIO3_B2 (bidir), GPIO3_B3 (bidir), GPIO3_B4 (bidir, see USBC_B[4A]), GPIO3_B5/UART3_TX_M1/PWM12_M0 (bidir), GPIO3_B6/UART3_RX_M1/PWM13_M0 (bidir), GPIO3_B7 (bidir, see eDP[3B]), GPIO3_C7/I2C5_SCL_M0_TP (bidir, see BATTERY_GESTION[4A]), GPIO3_D0/I2C5_SDA_M0_TP (bidir, see BATTERY_GESTION[4A]), GPIO3_D5/PWM11_M3/LCD_2_BL (bidir, see WIFI[3B], WIFI[3C]), HDMI0_TX0_N (bidir, see HDMI[4D]), HDMI0_TX0_P (bidir, see HDMI[4C]), HDMI0_TX1_N (bidir, see HDMI[4C]), HDMI0_TX1_P (bidir, see HDMI[4C]), HDMI0_TX2_N (bidir, see HDMI[4C]), HDMI0_TX2_P (bidir, see HDMI[4C]), HDMI0_TX3_N (bidir, see HDMI[4D]), HDMI0_TX3_P (bidir, see HDMI[4D]), HDMI0_TX_ON_H (bidir, see HDMI[1C], HDMI[2C]), HDMI0_TX_SBD_N (bidir, see HDMI[1A]), HDMI0_TX_SBD_P (bidir, see HDMI[1A]), HDMI1_TX0_N (out, see eDP[3B]), HDMI1_TX0_P (out, see eDP[3B]), HDMI1_TX1_N (out, see eDP[3B]), HDMI1_TX1_P (out, see eDP[3B]), HDMI1_TX2_N (out, see eDP[3A]), HDMI1_TX2_P (out, see eDP[3A]), HDMI1_TX3_N (out, see eDP[3A]), HDMI1_TX3_P (out, see eDP[3A]), HDMI1_TX_ON_H (bidir), HDMI1_TX_SBD_N (out, see eDP[3B]), HDMI1_TX_SBD_P (out, see eDP[3B]), HDMI_RX_CEC (bidir), HDMI_RX_CLK_N (bidir), HDMI_RX_CLK_P (bidir), HDMI_RX_D0_N (bidir), HDMI_RX_D0_P (bidir), HDMI_RX_D1_N (bidir), HDMI_RX_D1_P (bidir), HDMI_RX_D2_N (bidir), HDMI_RX_D2_P (bidir), HDMI_RX_SCL_M1 (out), HDMI_RX_SDA_M1 (bidir), HDMIIRX_HPDOUT_H (bidir), HDMITX0_CEC_M0 (bidir, see HDMI[3A]), HDMITX0_SCL_M0 (out, see HDMI[2A]), HDMITX0_SDA_M0 (bidir, see HDMI[2B]), HDMITX1_CEC_M2 (bidir), HDMITX1_SCL_M1 (out), HDMITX1_SDA_M1 (bidir), SD_CLK (out, see SDCARD[1B]), SDMMC0_CMD (bidir, see SDCARD[1A]), SDMMC0_D0 (bidir, see SDCARD[1B]), SDMMC0_D1 (bidir, see SDCARD[1B]), SDMMC0_D2 (bidir, see SDCARD[1A]), SDMMC0_D3 (bidir, see SDCARD[1A]), TYPEC0_SBU1_OUT (out), TYPEC0_SBU2_OUT (out), TYPEC1_SBU1 (in), TYPEC1_SBU2 (in), USB20_HOST0_D_N (bidir, see USB2_0[1C]), USB20_HOST0_D_P (bidir, see USB2_0[1C]), USB20_HOST1_D_N (bidir, see WIFI[1A]), USB20_HOST1_D_P (bidir, see WIFI[1A])

### Nets
+3V3_SD_SO: CON4.58
GND: CON4.1 CON4.2 CON4.7 CON4.8 CON4.13 CON4.14 CON4.19 CON4.20 CON4.25 CON4.26 CON4.31 CON4.32 CON4.37 CON4.38 CON4.43 CON4.44 CON4.49 CON4.50 CON4.55 CON4.61 CON4.62 CON4.68 CON4.80 CON4.83 CON4.96  [project net PACK-]
EN: CON4.90 ; port GPIO3_B4
GPIO0_A4/SDMMC_DET_L: CON4.70 ; port GPIO0_A4/SDMMC_DET_L
GPIO3_A0/SPI4_MISO_M1/PWM10_M0: CON4.87 ; port GPIO3_A0/SPI4_MISO_M1/PWM10_M0
GPIO3_A1/SPI4_MOSI_M1: CON4.89 ; port GPIO3_A1/SPI4_MOSI_M1
GPIO3_A2/SPI4_CLK_M1/UART8_TX_M1: CON4.91 ; port GPIO3_A2/SPI4_CLK_M1/UART8_TX_M1
GPIO3_A3/SPI4_CS0_M1/UART8_RX_M1: CON4.93 ; port GPIO3_A3/SPI4_CS0_M1/UART8_RX_M1
GPIO3_A4/SPI4_CS1_M1: CON4.95 ; port GPIO3_A4/SPI4_CS1_M1
GPIO3_A5: CON4.97 ; port GPIO3_A5
GPIO3_A6/LCD_RST: CON4.99 ; port GPIO3_A6/LCD_RST
GPIO3_A7: CON4.100 ; port GPIO3_A7
GPIO3_B0/PWM9_M0: CON4.82 ; port GPIO3_B0/PWM9_M0
GPIO3_B1/PWM2_M1/LCD_BL: CON4.84 ; port GPIO3_B1/PWM2_M1/LCD_BL
GPIO3_B2: CON4.86 ; port GPIO3_B2
GPIO3_B3: CON4.88 ; port GPIO3_B3
GPIO3_B5/UART3_TX_M1/PWM12_M0: CON4.92 ; port GPIO3_B5/UART3_TX_M1/PWM12_M0
GPIO3_B6/UART3_RX_M1/PWM13_M0: CON4.94 ; port GPIO3_B6/UART3_RX_M1/PWM13_M0
GPIO3_B7: CON4.98 ; port GPIO3_B7
GPIO3_C7/I2C5_SCL_M0_TP: CON4.81 ; port GPIO3_C7/I2C5_SCL_M0_TP
GPIO3_D0/I2C5_SDA_M0_TP: CON4.79 ; port GPIO3_D0/I2C5_SDA_M0_TP
GPIO3_D5/PWM11_M3/LCD_2_BL: CON4.85 ; port GPIO3_D5/PWM11_M3/LCD_2_BL
HDMI0_TX0_N: CON4.47 ; port HDMI0_TX0_N
HDMI0_TX0_P: CON4.45 ; port HDMI0_TX0_P
HDMI0_TX1_N: CON4.41 ; port HDMI0_TX1_N
HDMI0_TX1_P: CON4.39 ; port HDMI0_TX1_P
HDMI0_TX2_N: CON4.35 ; port HDMI0_TX2_N
HDMI0_TX2_P: CON4.33 ; port HDMI0_TX2_P
HDMI0_TX3_N: CON4.53 ; port HDMI0_TX3_N
HDMI0_TX3_P: CON4.51 ; port HDMI0_TX3_P
HDMI0_TX_ON_H: CON4.69 ; port HDMI0_TX_ON_H
HDMI0_TX_SBD_N: CON4.59 ; port HDMI0_TX_SBD_N
HDMI0_TX_SBD_P: CON4.57 ; port HDMI0_TX_SBD_P
HDMI1_TX0_N: CON4.17 ; port HDMI1_TX0_N
HDMI1_TX0_P: CON4.15 ; port HDMI1_TX0_P
HDMI1_TX1_N: CON4.11 ; port HDMI1_TX1_N
HDMI1_TX1_P: CON4.9 ; port HDMI1_TX1_P
HDMI1_TX2_N: CON4.5 ; port HDMI1_TX2_N
HDMI1_TX2_P: CON4.3 ; port HDMI1_TX2_P
HDMI1_TX3_N: CON4.23 ; port HDMI1_TX3_N
HDMI1_TX3_P: CON4.21 ; port HDMI1_TX3_P
HDMI1_TX_ON_H: CON4.77 ; port HDMI1_TX_ON_H
HDMI1_TX_SBD_N: CON4.29 ; port HDMI1_TX_SBD_N
HDMI1_TX_SBD_P: CON4.27 ; port HDMI1_TX_SBD_P
HDMI_RX_CEC: CON4.76 ; port HDMI_RX_CEC
HDMI_RX_CLK_N: CON4.48 ; port HDMI_RX_CLK_N
HDMI_RX_CLK_P: CON4.46 ; port HDMI_RX_CLK_P
HDMI_RX_D0_N: CON4.42 ; port HDMI_RX_D0_N
HDMI_RX_D0_P: CON4.40 ; port HDMI_RX_D0_P
HDMI_RX_D1_N: CON4.36 ; port HDMI_RX_D1_N
HDMI_RX_D1_P: CON4.34 ; port HDMI_RX_D1_P
HDMI_RX_D2_N: CON4.30 ; port HDMI_RX_D2_N
HDMI_RX_D2_P: CON4.28 ; port HDMI_RX_D2_P
HDMI_RX_SCL_M1: CON4.72 ; port HDMI_RX_SCL_M1
HDMI_RX_SDA_M1: CON4.74 ; port HDMI_RX_SDA_M1
HDMIIRX_HPDOUT_H: CON4.78 ; port HDMIIRX_HPDOUT_H
HDMITX0_CEC_M0: CON4.67 ; port HDMITX0_CEC_M0
HDMITX0_SCL_M0: CON4.63 ; port HDMITX0_SCL_M0
HDMITX0_SDA_M0: CON4.65 ; port HDMITX0_SDA_M0
HDMITX1_CEC_M2: CON4.75 ; port HDMITX1_CEC_M2
HDMITX1_SCL_M1: CON4.71 ; port HDMITX1_SCL_M1
HDMITX1_SDA_M1: CON4.73 ; port HDMITX1_SDA_M1
SD_CLK: CON4.60 ; port SD_CLK
SDMMC0_CMD: CON4.56 ; port SDMMC0_CMD
SDMMC0_D0: CON4.64 ; port SDMMC0_D0
SDMMC0_D1: CON4.66 ; port SDMMC0_D1
SDMMC0_D2: CON4.52 ; port SDMMC0_D2
SDMMC0_D3: CON4.54 ; port SDMMC0_D3
TYPEC0_SBU1_OUT: CON4.4 ; port TYPEC0_SBU1_OUT
TYPEC0_SBU2_OUT: CON4.6 ; port TYPEC0_SBU2_OUT
TYPEC1_SBU1: CON4.10 ; port TYPEC1_SBU1
TYPEC1_SBU2: CON4.12 ; port TYPEC1_SBU2
USB20_HOST1_D_N: CON4.18 ; port USB20_HOST1_D_N
USB20_HOST1_D_P: CON4.16 ; port USB20_HOST1_D_P
usb_N: CON4.24 ; port USB20_HOST0_D_N
usb_P: CON4.22 ; port USB20_HOST0_D_P

### Layout directives
differential pair: HDMI0_TX0_N, HDMI0_TX0_P, HDMI0_TX1_N, HDMI0_TX1_P, HDMI0_TX2_N, HDMI0_TX2_P, HDMI0_TX3_N, HDMI0_TX3_P, HDMI0_TX_SBD_N, HDMI0_TX_SBD_P, HDMI1_TX0_N, HDMI1_TX0_P, HDMI1_TX1_N, HDMI1_TX1_P, HDMI1_TX2_N, HDMI1_TX2_P, HDMI1_TX3_N, HDMI1_TX3_P, HDMI1_TX_SBD_N, HDMI1_TX_SBD_P, HDMI_RX_CLK_N, HDMI_RX_CLK_P, HDMI_RX_D0_N, HDMI_RX_D0_P, HDMI_RX_D1_N, HDMI_RX_D1_P, HDMI_RX_D2_N, HDMI_RX_D2_P, USB20_HOST1_D_N, USB20_HOST1_D_P, usb_N, usb_P

### Notes on the sheet
- Titre :
- Conception :
- Date :
- Approbation :
- Heure :
- Révision :
- Feuille
- de
- Fichier :

### Library data of the parts
CON4 = DF40HC(3.0)-100DS-0.4V(51): as CON1 on sheet CONNECTEUR_1; Datasheet Link: https://componentsearchengine.com/Datasheets/1/DF40HC(3.0)-100DS-0.4V(51.pdf; Height: 3.05mm; Manufacturer_Part_Number: DF40HC(3.0)-100DS-0.4V(51; Mouser Part Number: 798-DF40HC30100DS451; Mouser Price/Stock: https://www.mouser.co.uk/ProductDetail/Hirose-Connector/DF40HC3.0-100DS-0.4V51?qs=%252BAZVS4b%2FkgIV%252B3vHYy2dCA%3D%3D; Arrow Part Number: DF40HC(3.0)-100DS-0.4V(51; Arrow Price/Stock: https://www.arrow.com/en/products/df40hc-3.0-100ds-0.4v-51/hirose-electric; Supplier: Digikey; Supplier Part Number: 26-DF40HC(3.0)-100DS-0.4V(51)CT-ND; Manufacturer: Hirose; Manufacturer Part Number: DF40HC(3.0)-100DS-0.4V(51; RoHS: Yes; Category: Headers and Wire Housings; Stock: 5604; Pricing: 1=2.61, 10=2.219, 25=2.0796, 50=1.9804, 100=1.8858, 250=1.76764, 500=1.68326, 1000=1.6524 (USD); Mounting Technology: Surface Mount; Contact Plating: Gold; Contact Material: Nickel,Gold; Housing Color: Black; Min Operating Temperature: -35°C; Max Operating Temperature: 85°C; Package Quantity: 3000; Packaging: Tape and Reel; Number of Rows: 2; Connector Type: Receptacle; Series: DF40; Contact Voltage Rating (DC): 30V; Number of Contacts: 100; Orientation: Straight; Voltage Rating: 30V; Length: 22.6mm; Width: 3.38mm; ComponentLink1URL: https://datasheet.ciiva.com/13559/ed-df40-20140305-13559540.pdf?src-supplier=Mouser; ComponentLink1Description: https://datasheet.ciiva.com/13559/ed-df40-20140305-13559540.pdf?src-supplier=Mouser

## Sheet eDP.SchDoc: DARKYDEN_eDP
size Letter; ApprovedBy: APPROUVÉ PAR; Author: Harold Malbrouck; Organization: Cegep Limoilou; Address1: 1300, 8e Avenue; Address2: Québec, QC; Address3: Canada; Address4: G1J 5L5; Revision: Rev.A; SheetNumber: 15; SheetTotal: 22
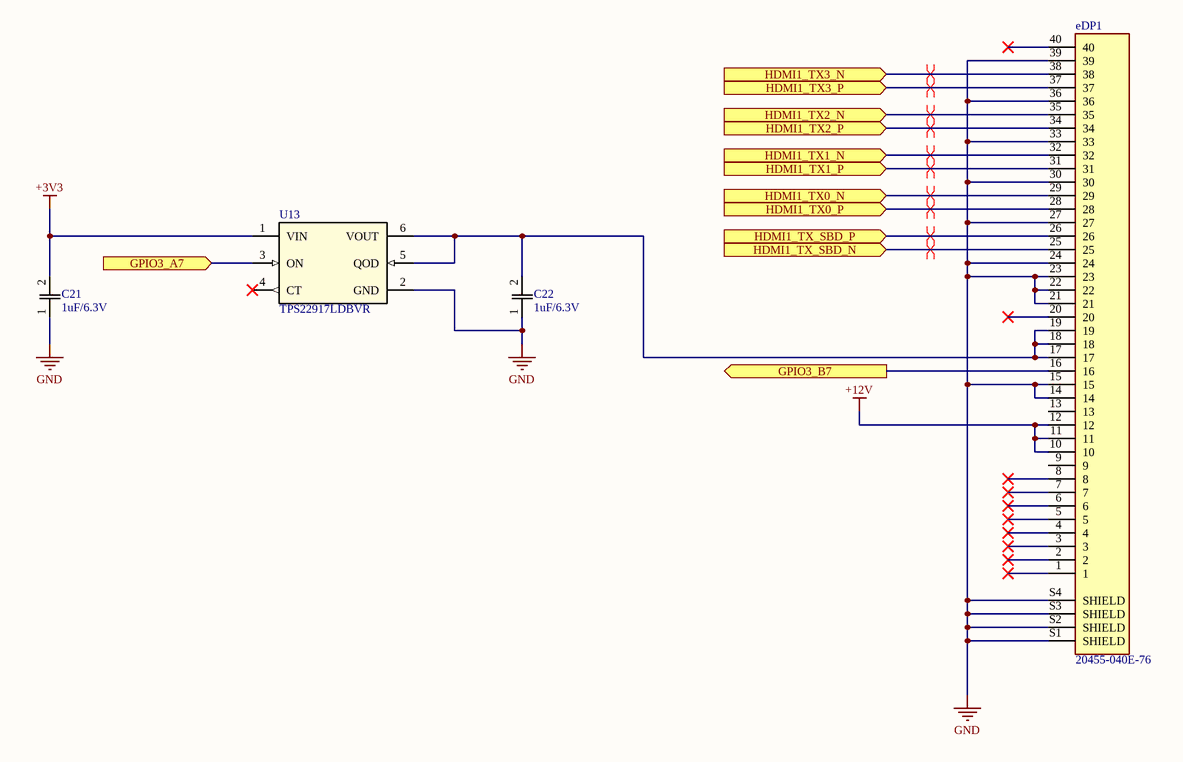
[diagram p14: eDP.SchDoc]

### Parts
C21  1uF/6.3V  [C0805]
C22  1uF/6.3V  [C0805]
eDP1  20455-040E-76  [IPEX_20455-040E-76]
U13  TPS22917LDBVR  [DBV0006_L]

### Ports
GPIO3_A7 (in, see CONNECTEUR_4[3C]), GPIO3_B7 (out, see CONNECTEUR_4[3C]), HDMI1_TX0_N (in, see CONNECTEUR_4[1A]), HDMI1_TX0_P (in, see CONNECTEUR_4[1A]), HDMI1_TX1_N (in, see CONNECTEUR_4[1A]), HDMI1_TX1_P (in, see CONNECTEUR_4[1A]), HDMI1_TX2_N (in, see CONNECTEUR_4[1A]), HDMI1_TX2_P (in, see CONNECTEUR_4[1A]), HDMI1_TX3_N (in, see CONNECTEUR_4[1A]), HDMI1_TX3_P (in, see CONNECTEUR_4[1A]), HDMI1_TX_SBD_N (in, see CONNECTEUR_4[1B]), HDMI1_TX_SBD_P (in, see CONNECTEUR_4[1B])

### Nets
+3V3: C21.2 U13.1(VIN)  [project net VDD33A]
+12V: eDP1.10 eDP1.11 eDP1.12  [project net Vout]
GND: C21.1 C22.1 eDP1.14 eDP1.15 eDP1.21 eDP1.22 eDP1.23 eDP1.24 eDP1.27 eDP1.30 eDP1.33 eDP1.36 eDP1.39 eDP1.S1(SHIELD) eDP1.S2(SHIELD) eDP1.S3(SHIELD) eDP1.S4(SHIELD) U13.2(GND)  [project net PACK-]
GPIO3_A7: U13.3(ON) ; port GPIO3_A7
GPIO3_B7: eDP1.16 ; port GPIO3_B7
HDMI1_TX0_N: eDP1.29 ; port HDMI1_TX0_N
HDMI1_TX0_P: eDP1.28 ; port HDMI1_TX0_P
HDMI1_TX1_N: eDP1.32 ; port HDMI1_TX1_N
HDMI1_TX1_P: eDP1.31 ; port HDMI1_TX1_P
HDMI1_TX2_N: eDP1.35 ; port HDMI1_TX2_N
HDMI1_TX2_P: eDP1.34 ; port HDMI1_TX2_P
HDMI1_TX3_N: eDP1.38 ; port HDMI1_TX3_N
HDMI1_TX3_P: eDP1.37 ; port HDMI1_TX3_P
HDMI1_TX_SBD_N: eDP1.25 ; port HDMI1_TX_SBD_N
HDMI1_TX_SBD_P: eDP1.26 ; port HDMI1_TX_SBD_P
NetC22_2: C22.2 eDP1.17 eDP1.18 eDP1.19 U13.5(QOD) U13.6(VOUT)

Not connected (* = marked no-connect by the designer): eDP1 1* 2* 3* 4* 5* 6* 7* 8* 9 13 20* 40*; U13 4(CT)*

### Layout directives
differential pair: HDMI1_TX0_N, HDMI1_TX0_P, HDMI1_TX1_N, HDMI1_TX1_P, HDMI1_TX2_N, HDMI1_TX2_P, HDMI1_TX3_N, HDMI1_TX3_P, HDMI1_TX_SBD_N, HDMI1_TX_SBD_P

### Notes on the sheet
- Titre :
- Conception :
- Date :
- Approbation :
- Heure :
- Révision :
- Feuille
- de
- Fichier :

### Library data of the parts
C21 C22 = C0805C105K9RACTU: 1 uF, 6.3 V, ± 10%, X7R, 0805 [2012 Metric] Multilayer Ceramic Capacitor,; Manufacturer_Name: KEMET; Value: 1uF; Voltage Rating: 6.3V; Datasheet Link: https://content.kemet.com/datasheets/KEM_C1002_X7R_SMD.pdf; Height: 1.1mm; Manufacturer_Part_Number: C0805C105K9RACTU; Mouser Part Number: 80-C0805C105K9R; Mouser Price/Stock: https://www.mouser.co.uk/ProductDetail/KEMET/C0805C105K9RACTU?qs=Nnkldhwoc36daYb4WU%2Fecw%3D%3D; Arrow Part Number: C0805C105K9RACTU; Arrow Price/Stock: https://www.arrow.com/en/products/c0805c105k9ractu/kemet-corporation?utm_currency=USD&region=nac; Supplier: Digikey; Supplier Part Number: 399-13161-1-ND; Manufacturer: KEMET; Manufacturer Part Number: C0805C105K9RACTU; RoHS: Yes; Category: Ceramic Capacitors; Stock: 8847; Pricing: 1=0.49, 10=0.397, 100=0.3017, 1000=0.24335, 2500=0.22102, 5000=0.20619, 7500=0.16784, 12500=0.12939, 17500=0.02492, 25000=0.02414, 62500=0.02244, 125000=0.02142, 250000=0.02059 (USD); Mounting Technology: Surface Mount; Case/Package: 0805; Case Code (Metric): 2012; Case Code (Imperial): 0805; Dielectric Material: Ceramic; Min Operating Temperature: -55°C; Max Operating Temperature: 125°C; Packaging: Tape and Reel; Tolerance: 10%; Package Quantity: 4000; Voltage Rating (DC): 6.3V; Dielectric: X7R; Termination: SMD/SMT; Series: C0805C; Construction: Flat; Length: 2mm; Width: 1.2mm; Thickness: 0.039inch; Lead Pitch: 0.75mm; Depth: 1.25mm; Radiation Hardening: No; RoHS Compliant: Yes; ComponentLink1URL: https://datasheet.ciiva.com/5416/kem-c1002-x7r-smd-5416463.pdf?src-supplier=Mouser; ComponentLink1Description: https://datasheet.ciiva.com/5416/kem-c1002-x7r-smd-5416463.pdf?src-supplier=Mouser
eDP1 = 20455-040E-76: Conn Wire to Board RCP 40 POS 0.5mm Solder RA Side Entry SMDCABLINE® T/R; Manufacturer: I-PEX; Package: None; Price: None; Value: *; MP: 20455-040E-76; Availability: Unavailable; Supplier: Digikey; Supplier Part Number: 5378-20455-040E-76CT-ND; Manufacturer Part Number: 20455-040E-76; RoHS: No; Category: FFC / FPC; Stock: 7447; Pricing: 1=2.21, 10=1.878, 25=1.7604, 50=1.6764, 100=1.5962, 250=1.49624, 500=1.4248, 1000=1.377 (USD); RoHS Compliant: No; ComponentLink1URL: https://datasheet.octopart.com/20455-040E-76-I-PEX-datasheet-154856138.pdf?src-supplier=Future+Electronics; ComponentLink1Description: https://datasheet.octopart.com/20455-040E-76-I-PEX-datasheet-154856138.pdf?src-supplier=Future+Electronics; ComponentLink2URL: http://datasheet.octopart.com/20455-040E-76-I-PEX-datasheet-154856138.pdf?src-supplier=Quest; ComponentLink2Description: http://datasheet.octopart.com/20455-040E-76-I-PEX-datasheet-154856138.pdf?src-supplier=Quest
U13 = TPS22917LDBVR: 5.5-V, 2-A, 80-mΩ , 10-nA leakage load switch adj. rise time and adj output discharge 6-SOT-23 -45 to 125; Mfr_Name: Texas Instruments; TYPE: TYPE; RefDes: RefDes; Supplier: Digikey; Supplier Part Number: 296-TPS22917LDBVRCT-ND; Manufacturer: Texas Instruments; Manufacturer Part Number: TPS22917LDBVR; RoHS: No; Category: Integrated Circuits (ICs); Stock: 10229; Pricing: 1=0.41, 10=0.284, 25=0.2528, 100=0.2188, 250=0.20248, 500=0.1927, 1000=0.18463 (USD); Case/Package: 926Case; Pins: 6NUMBER; Length: 2.9mm; Width: 1.6mm; Thickness: 1.2mm